# EAGLE design piezo-preamp-tickler_V1-01a (EAGLE 8.0.1)

## Sheet 1 of 2
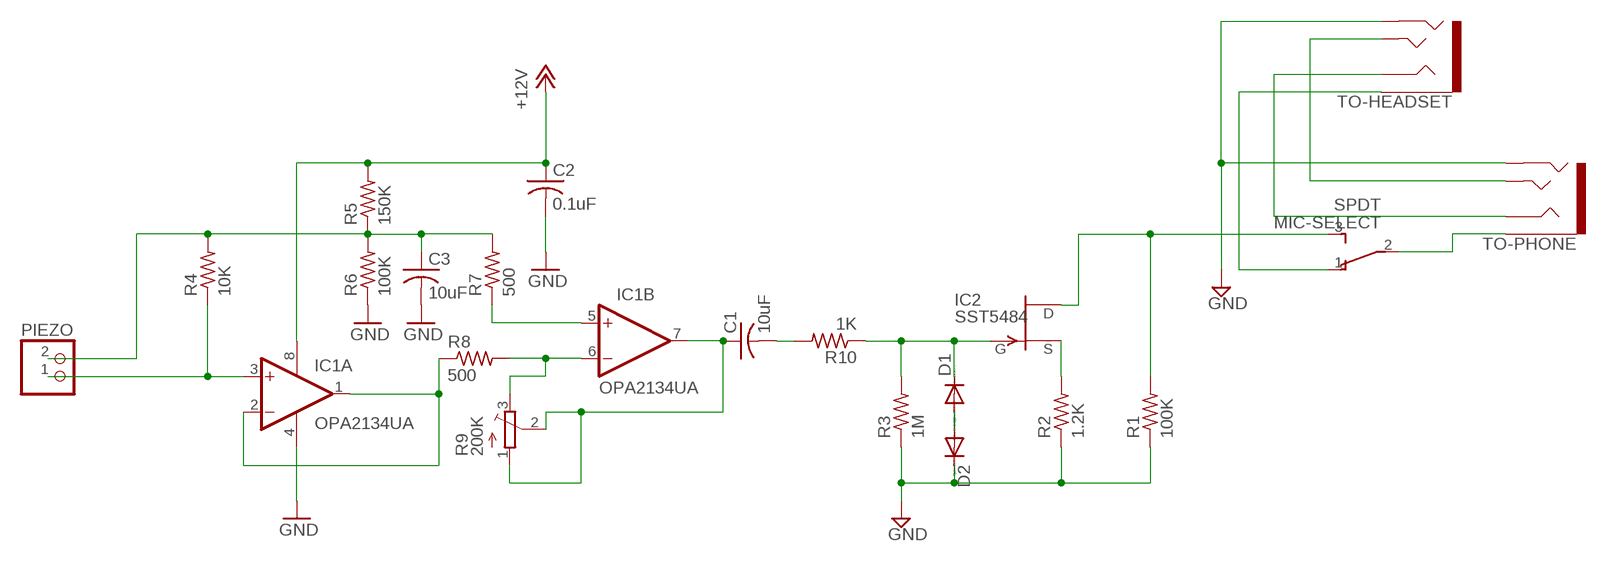
[diagram p0: schematic, sheet 1]

### Parts
C1  10uF  C-USC0805K  [C0805K]
C2  0.1uF  C-USC0805K  [C0805K]
C3  10uF  C-USC0805K  [C0805K]
D1  DIODE-SOD123  [SOD123]
D2  DIODE-SOD123  [SOD123]
IC1  OPA2134UA  [SO08]
IC2  SST5484  [SOT23]
MIC-SELECT  SPDT  SWITCH_SPDTTE-CONNECT  [SWITCH_SPDT-TE-CONNECT]
PIEZO  JST_2PIN-THM  [JST-PH-2-THM]
R1  100K  R-US_R0603  [R0603]
R2  1.2K  R-US_R0603  [R0603]
R3  1M  R-US_R0603  [R0603]
R4  10K  R-US_R0603  [R0603]
R5  150K  R-US_R0603  [R0603]
R6  100K  R-US_R0603  [R0603]
R7  500  R-US_R0603  [R0603]
R8  500  R-US_R0603  [R0603]
R9  200K  TRIMPOTTC33X  [TC33X]
R10  1K  R-US_R0603  [R0603]
TO-HEADSET  AUDIO-JACK3LGPADS  [AUDIO-JACK-TRRS-SMD]
TO-PHONE  AUDIO-JACK3LGPADS  [AUDIO-JACK-TRRS-SMD]

### Nets
+12V: C2.1 IC1.8(A:V+) R5.2 ; also sheet 2
GND: C2.2 C3.2 D2.C IC1.4(A:V-) R1.1 R2.1 R3.1 R6.1 TO-HEADSET.RING2 TO-PHONE.RING2 ; also sheet 2
N$1: D1.A D2.A
N$3: IC2.2(S) R2.2
N$5: IC1.5(B:+IN) R7.1
N$6: C1.1 IC1.7(B:OUT) R9.1(A) R9.2(S)
N$7: IC1.6(B:-IN) R8.2 R9.3(E)
N$8: C3.1 PIEZO.2 R4.2 R5.1 R6.2 R7.2
N$9: IC1.3(A:+IN) PIEZO.1 R4.1
N$10: D1.C IC2.3(G) R3.2 R10.1
N$11: C1.2 R10.2
N$12: MIC-SELECT.1 TO-HEADSET.EARTH
N$13: TO-HEADSET.TIP TO-PHONE.TIP
N$14: IC1.1(A:OUT) IC1.2(A:-IN) R8.1
N$15: TO-HEADSET.RING1 TO-PHONE.RING1
N$17: MIC-SELECT.2 TO-PHONE.EARTH
SELECT: IC2.1(D) MIC-SELECT.3 R1.2

## Sheet 2 of 2
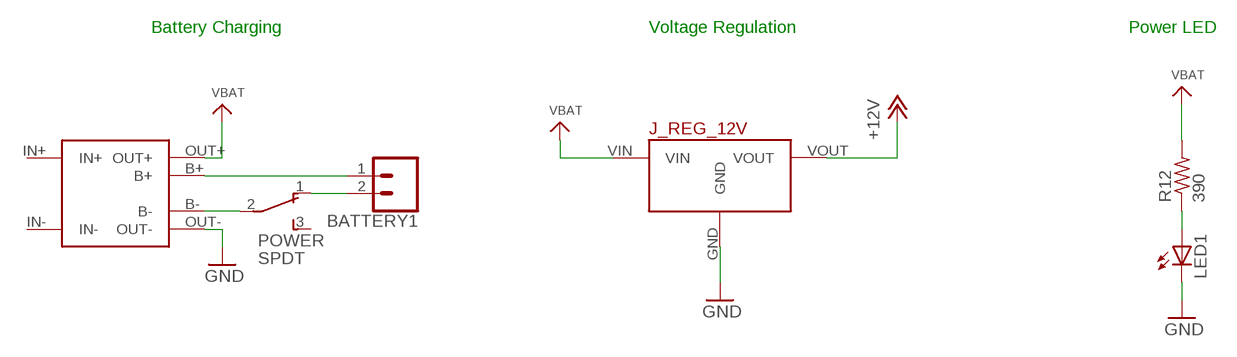
[diagram p1: schematic, sheet 2]

### Parts
BATTERY1  CONN_02LOCK  [1X02_LOCK]
J_REG_12V  POLOLU_VOLTAGE_REGULATORS_3PIN  [POLOLU_5V-12V_STEPUP_U3V12F5-U3V12F12]
LED1  LED3MM  [LED3MM]
POWER  SPDT  SWITCH_SPDTTE-CONNECT  [SWITCH_SPDT-TE-CONNECT]
R12  390  R-US_R0805  [R0805]
USB-LIPO-CHARGER  TP4056-MODULE  [TP4056-LITHIUM-PROTECTED-MODULE]

### Nets
+12V: J_REG_12V.VOUT ; also sheet 1
GND: J_REG_12V.GND LED1.K(C) USB-LIPO-CHARGER.OUT- ; also sheet 1
N$18: LED1.A R12.1
N$19: BATTERY1.1 USB-LIPO-CHARGER.B+
N$20: POWER.2 USB-LIPO-CHARGER.B-
N$21: BATTERY1.2 POWER.1
VBAT: J_REG_12V.VIN R12.2 USB-LIPO-CHARGER.OUT+
Unconnected: POWER.3

### Notes on the sheet
- Battery Charging | Voltage Regulation | Power LED

## Power pins joined to a net without a drawn wire
IN+: USB-LIPO-CHARGER.IN+
IN-: USB-LIPO-CHARGER.IN-

## Library data of the parts
BATTERY1 = SparkFun-Connectors:CONN_02: Multi connection point. Often used as Generic Header-pin footprint for 0.1 inch spaced/style header connections On any of the 0.1 inch spaced packages, you can populate with these: Break Away Headers - Straight <https://www.sparkfun.com/products/116> (PRT-00116) Break Away Male Headers - Right Angle <https://www.sparkfun.com/products/553> (PRT-00553) Female Headers <https://www.sparkfun.com/products/115> (PRT-00115) Break Away Headers - Machine Pin <https://www.sparkfun.com/products/117> (PRT-00117) Break Away Female Headers - Swiss Machine Pin <https://www.sparkfun.com/products/743> (PRT-00743) For SCREWTERMINALS and SPRING TERMINALS visit here: Screw Terimnals on SparkFun.com <https://www.sparkfun.com/search/results?term=Screw+Terminals> (5mm/3.5mm/2.54mm spacing) This device is also useful as a general connection point to wire up your design to another part of your project. Our various solder wires solder well into these plated through hole pads. Hook-Up Wire - Assortment (Stranded, 22 AWG) <https://www.sparkfun.com/products/11375> (PRT-11375) Hook-Up Wire - Assortment (Solid Core, 22 AWG) <https://www.sparkfun.com/products/11367> (PRT-11367) View the entire wire category on our website here <https://www.sparkfun.com/categories/141> Special notes: Molex polarized connector foot print use with: PRT-08233 with associated crimp pins and housings. 2.54_SCREWTERM for use with PRT-10571. 3.5mm Screw Terminal footprints for PRT-08084 5mm Screw Terminal footprints for use with PRT-08432
C1-C3 = adafruit:C-US: CAPACITOR, American symbol
D1 D2 = diode:DIODE-: DIODE
IC1 = linear:OPA2*: Dual Operational Amplifier Low Power, Single-Supply, Rail-To-Rail Operational Amplifier Source: http://focus.ti.com/lit/ds/symlink/opa2345.pdf http://focus.ti.com .. opa241.pdf http://focus.ti.com/lit/ds/symlink/opa2134.pdf
IC2 = transistor-fet:?548*: N-Channel JFETs Source: VISHAY 2N5484.pdf Compatible: TO92 2N5245 J304 J305 U310 J308 J309 J310 TO72 2N4416 2N4416A 2N3823 2N4351 3N169 3N170 3N171 MFE3002 TO18 2N3796 2N3797 MFE825 Source: Motorola European Master Guide Pacge 3-59
J_REG_12V = CMU-ArtFab:POLOLU_VOLTAGE_REGULATORS_3PIN: Polulu 5V Step-Up/Step-Down Voltage REgulator S7V7F5
LED1 = led:LED: LED OSRAM: - CHIPLED LG R971, LG N971, LY N971, LG Q971, LY Q971, LO R971, LY R971 LH N974, LH R974 LS Q976, LO Q976, LY Q976 LO Q996 - Hyper CHIPLED LW Q18S LB Q993, LB Q99A, LB R99A - SideLED LS A670, LO A670, LY A670, LG A670, LP A670 LB A673, LV A673, LT A673, LW A673 LH A674 LY A675 LS A676, LA A676, LO A676, LY A676, LW A676 LS A679, LY A679, LG A679 - Hyper Micro SIDELED® LS Y876, LA Y876, LO Y876, LY Y876 LT Y87S - SmartLED LW L88C, LW L88S LB L89C, LB L89S, LG L890 LS L89K, LO L89K, LY L89K LS L896, LA L896, LO L896, LY L896 - TOPLED LS T670, LO T670, LY T670, LG T670, LP T670 LSG T670, LSP T670, LSY T670, LOP T670, LYG T670 LG T671, LOG T671, LSG T671 LB T673, LV T673, LT T673, LW T673 LH T674 LS T676, LA T676, LO T676, LY T676, LB T676, LH T676, LSB T676, LW T676 LB T67C, LV T67C, LT T67C, LS T67K, LO T67K, LY T67K, LW E67C LS E67B, LA E67B, LO E67B, LY E67B, LB E67C, LV E67C, LT E67C LW T67C LS T679, LY T679, LG T679 LS T770, LO T770, LY T770, LG T770, LP T770 LB T773, LV T773, LT T773, LW T773 LH T774 LS E675, LA E675, LY E675, LS T675 LS T776, LA T776, LO T776, LY T776, LB T776 LHGB T686 LT T68C, LB T68C - Hyper Mini TOPLED® LB M676 - Mini TOPLED Santana® LG M470 LS M47K, LO M47K, LY M47K Source: http://www.osram.convergy.de LUXEON: - LUMILED® LXK2-PW12-R00, LXK2-PW12-S00, LXK2-PW14-U00, LXK2-PW14-V00 LXK2-PM12-R00, LXK2-PM12-S00, LXK2-PM14-U00 LXK2-PE12-Q00, LXK2-PE12-R00, LXK2-PE12-S00, LXK2-PE14-T00, LXK2-PE14-U00 LXK2-PB12-K00, LXK2-PB12-L00, LXK2-PB12-M00, LXK2-PB14-N00, LXK2-PB14-P00, LXK2-PB14-Q00 LXK2-PR12-L00, LXK2-PR12-M00, LXK2-PR14-Q00, LXK2-PR14-R00 LXK2-PD12-Q00, LXK2-PD12-R00, LXK2-PD12-S00 LXK2-PH12-R00, LXK2-PH12-S00 LXK2-PL12-P00, LXK2-PL12-Q00, LXK2-PL12-R00 Source: www.luxeon.com KINGBRIGHT: KA-3528ASYC Source: www.kingbright.com
MIC-SELECT POWER = CMU-ArtFab:SWITCH_SPDT
PIEZO = adafruit:JST_2PIN: JST 2-Pin Connectors of various flavors SMT-RA (S2B-PH-SM4) 4UConnector #17311 SMT (B2B-PH-SM4) THM-RA (S2B-PH) THM (B2B-PH)
R1-R8 R10 R12 = CMU-ArtFab:R-US_: RESISTOR, American symbol
R9 = adafruit:TRIMPOT: SMT trimmer potentiometer part number TC33X http://www.ladyada.net/library/eagle
TO-HEADSET TO-PHONE = Daniel:AUDIO-JACK3: Audio jack - 3.5mm TRRS variety - two rings.
USB-LIPO-CHARGER = CMU-ArtFab:TP4056-MODULE

## Net classes
0 default: width 0.152 mm, clearance 0.2 mm

## Board
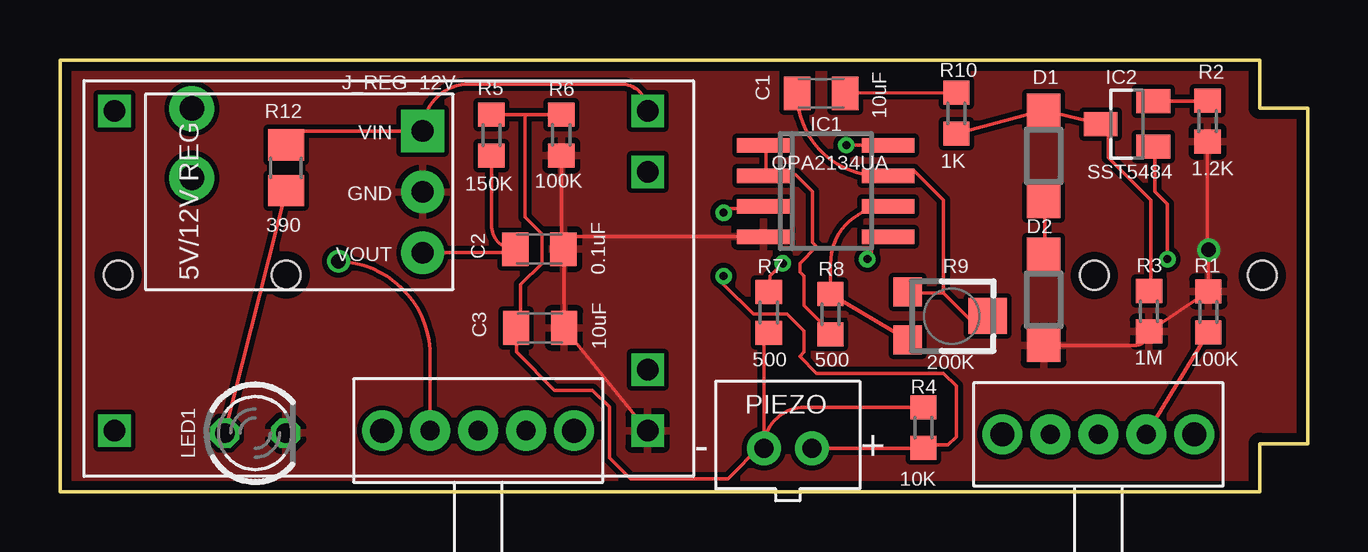
[diagram p2: board, top side]
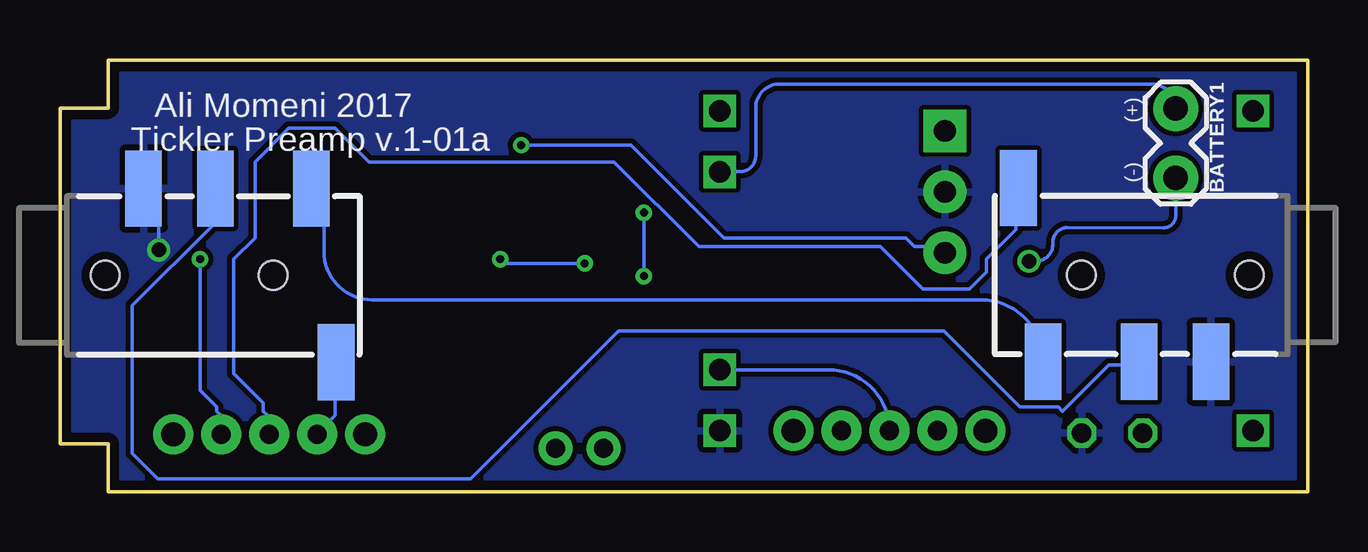
[diagram p3: board, bottom side, seen from below]

Size 52 x 18 mm. Coordinates in mm from the lower left corner, seen from the top.
Outline: 0,0 50,0 50,2 52,2 52,16 50,16 50,18 0,18 0,0
Copper layers (1*16): Top 0.0356mm / dielectric 1.5011mm / Bottom 0.0356mm
Design rules "oshpark-2layer": minimum track width 6mil, minimum drill 13mil, track to track 6mil, track to pad 6mil, pad to pad 6mil, via to via 6mil, smd to smd 6mil, copper to edge 15mil, drill to drill 6mil, minimum pad ring 7mil, minimum via ring 7mil, stop-mask expansion 2.5mil, vias tented up to drill 0mil, thermal gap 10mil

### Footprints (pad centres in the part's own frame; a part is rotated, then mirrored left to right if it is on the bottom)
1X02_LOCK = drill 1.016 pad 1.88: 1 -0.178,0; 2 2.718,0
C0805K = smd 1.1 x 1.4: 1 -1,0; 2 1,0
SOD123 = smd 1.4 x 1.4: A 1.9,0; C -1.9,0
SO08 = smd 0.6 x 2.2: 1 -1.905,-2.6; 2 -0.635,-2.6; 3 0.635,-2.6; 4 1.905,-2.6; 5 1.905,2.6; 6 0.635,2.6; 7 -0.635,2.6; 8 -1.905,2.6
SOT23 = smd 1 x 1.4: 1 -0.95,-1.1; 2 0.95,-1.1; 3 0,1.1
POLOLU_5V-12V_STEPUP_U3V12F5-U3V12F12 = drill 0.9 pad 1.778: GND 0,-6.35; VOUT -2.54,-6.35 | drill 0.9 pad 1.778 square: VIN 2.54,-6.35
LED3MM = drill 0.813 octagon: A -1.27,0; K 1.27,0
SWITCH_SPDT-TE-CONNECT = drill 0.8 pad 1.676: 1 2,0; 2 4,0; 3 6,0 | drill 1 pad 1.676: MOUNT1 0,0; MOUNT2 8,0
JST-PH-2-THM = drill 0.8 pad 1.422: 1 1,0; 2 -1,0
R0603 = smd 1 x 1.1: 1 -0.85,0; 2 0.85,0
TC33X = smd 1.2 x 1.2: 1 -1,-1.825; 3 1,-1.825 | smd 1.5 x 1.6: 2 0,1.5
R0805 = smd 1.3 x 1.5: 1 -0.95,0; 2 0.95,0
AUDIO-JACK-TRRS-SMD = smd 1.524 x 3.175: EARTH 11.227,-3.619; RING1 6.2,3.619; RING2 3.2,3.619; TIP 10.2,3.619 | hole 1.2: 1.6,0; 8.6,0
TP4056-LITHIUM-PROTECTED-MODULE = drill 0.9 square: B+ 10.795,4.445; B- 10.795,-3.81; IN+ -11.43,6.985; IN- -11.43,-6.35; OUT+ 10.795,6.985; OUT- 10.795,-6.35

### Placement (x,y rotation side)
BATTERY1  5.5,15.79 270 bottom
C1  31.73,16.61 0 top
C2  19.98,10.11 0 top
C3  20.01,6.83 0 top
D1  41,14 270 top
D2  41,8 90 top
IC1  31.92,12.54 270 top
IC2  44.47,15.33 90 top
J_REG_12V  8.77,12.5 90 top
LED1  8.14,2.44 0 top
MIC-SELECT  39.28,2.38 0 top
PIEZO  30.34,1.81 0 top
POWER  13.43,2.54 0 top
R1  47.86,7.49 270 top
R2  47.83,15.45 90 top
R3  45.39,7.52 90 top
R4  35.99,2.67 90 top
R5  17.98,14.86 270 top
R6  20.9,14.87 90 top
R7  29.54,7.46 270 top
R8  32.12,7.39 90 top
R9  37.16,7.32 270 top
R10  37.37,15.78 90 top
R12  9.42,13.5 90 top
TO-HEADSET  51.72,9.02 0 bottom
TO-PHONE  0.82,9.03 180 bottom
USB-LIPO-CHARGER  13.7,8.89 0 top

### Tracks (layer width: path | path; a pad name or v marks a point on that pad's centre or on a via)
+12V  (via drill 0.33)
  Top 0.152: J_REG_12V.VOUT 18.83,9.96 arc90 C2.1 arc-90 17.98,11.11 R5.2 | v32.77,14.45 34.36,14.45 IC1.8
  Bottom 0.152: v32.77,14.45 28.19,14.45 24.32,10.57 16.74,10.57 16.39,10.22 15.33,10.22 15.15,10.04 J_REG_12V.VOUT
GND  (via drill 0.6)
  Top 0.152: C2.2 arc-90 21.01,10.08 C3.2 USB-LIPO-CHARGER.OUT- | C2.2 arc-90 20.9,10.19 R6.1 | C2.2 arc-90 21.5,10.63 IC1.4 | R2.1 47.83,10.13 arc90 v47.88,10.08 arc90 47.86,10.06 R1.1 R3.1 arc-90 44.82,6.1 D2.C
  Bottom 0.152: v47.88,10.08 47.88,12 arc-90 TO-HEADSET.RING2
  pour Top: -1,19.03 53,19.03 53,-0.97 -1,-0.97
  pour Bottom: -1,19.03 53,19.03 53,-0.97 -1,-0.97
N$1
  Top 0.152: D2.A 41.05,10.04 41.05,11.98 D1.A
N$3
  Top 0.152: IC2.2 47.83,16.28 R2.2
N$5  (via drill 0.33)
  Top 0.152: v30.13,9.52 29.6,8.99 29.6,8.46 R7.1 | v33.65,9.69 33.83,9.87 33.83,10.4 34.01,10.57 34.36,10.57 IC1.5
  Bottom 0.152: v30.13,9.52 33.48,9.52 v33.65,9.69
N$6
  Top 0.152: C1.1 arc90 34.16,13.17 IC1.7 34.53,13.21 34.71,13.39 35.59,13.39 36.83,12.16 36.83,8.28 | 36.83,8.28 35.42,8.28 R9.1 | 36.83,8.28 37.88,7.22 38.59,7.22 R9.2
N$7
  Top 0.152: R9.3 R8.2 32.12,9.49 arc-90 IC1.6
N$8
  Top 0.152: R7.2 arc90 29.34,6.41 PIEZO.2 | PIEZO.2 arc-90 31.05,3.52 R4.2 | R6.2 19.38,15.72 | 19.38,15.72 18,15.72 arc90 R5.1 | PIEZO.2 29.25,1.94 27.84,0.53 23.79,0.53 22.91,1.41 22.91,3.52 22.2,4.23 20.61,4.23 19.03,5.82 19.03,6.7 C3.1 19.03,6.87 19.21,7.05 19.21,8.63 20.09,9.52 20.09,10.75 19.38,11.45 19.38,15.72
N$9  (via drill 0.33)
  Top 0.152: PIEZO.1 35.98,1.81 arc90 R4.1 36.12,1.94 37,1.94 37.35,2.29 37.35,4.41 36.83,4.93 31.54,4.93 30.84,5.64 31.01,5.82 31.01,6.7 30.31,7.4 28.9,7.4 27.66,8.63 v27.66,8.99 | v27.66,11.63 27.84,11.8 29.25,11.8 IC1.3
  Bottom 0.152: v27.66,8.99 v27.66,11.63
N$10
  Top 0.152: R10.1 D1.C IC2.3 43.52,15.15 43.7,14.98 43.7,13.92 45.46,12.16 45.46,8.46 R3.2
N$11
  Top 0.152: C1.2 R10.2
N$12
  Bottom 0.152: TO-HEADSET.EARTH 40.53,5.29 40.53,3.17 41.23,2.47 MIC-SELECT.1
N$13
  Bottom 0.152: TO-PHONE.TIP arc-90 13.61,8 39,8 arc90 41,10 41,12 arc90 41.52,12.52 TO-HEADSET.TIP
N$14
  Top 0.152: 29.43,13.21 30.66,13.21 31.36,12.51 31.36,10.4 31.54,10.22 30.84,9.52 30.84,9.16 31.01,8.99 31.01,7.75 32.07,6.7 R8.1 | 29.43,13.21 29.43,14.27 IC1.1 | 29.43,13.21 IC1.2
N$15
  Bottom 0.152: TO-PHONE.RING1 7.05,5.29 8.28,5.29 10.22,3.35 10.4,3.52 11.98,3.52 15.15,6.7 28.72,6.7 34.89,0.53 47.93,0.53 48.98,1.59 48.98,7.75 45.64,11.1 45.64,12.51 TO-HEADSET.RING1
N$17
  Bottom 0.152: TO-PHONE.EARTH 12.16,12.51 12.16,10.92 13.39,9.69 13.39,9.16 14.1,8.46 16.03,8.46 17.8,10.22 25.37,10.22 28.9,13.74 39.12,13.74 40.53,15.15 42.46,15.15 43.87,13.74 43.87,10.57 44.76,9.69 44.76,4.93 43.52,3.7 43.52,3.35 43.34,3.17 43.34,2.47 MIC-SELECT.2
N$18
  Top 0.152: LED1.A R12.1
N$19
  Bottom 0.152: USB-LIPO-CHARGER.B+ 23.66,13.34 arc-90 23,14 23,16 arc90 22,17 6.52,17 arc90 BATTERY1.1
N$20
  Bottom 0.152: USB-LIPO-CHARGER.B- 19.97,5.08 arc90 POWER.2
N$21  (via drill 0.6)
  Top 0.152: POWER.1 15.43,5.57 arc90 v11.61,9.61
  Bottom 0.152: 5.46,13.05 arc-90 BATTERY1.2 5.5,11.51 arc90 6,11 10.03,11.02 arc-90 10.62,10.32 arc90 11.34,9.61 v11.61,9.61
SELECT  (via drill 0.33)
  Top 0.152: MIC-SELECT.3 R1.2 | v46.16,9.69 46.16,11.98 45.64,12.51 45.64,14.27 IC2.1
  Bottom 0.152: v46.16,9.69 46.16,4.23 45.46,3.52 45.46,3.35 45.28,3.17 45.28,2.47 MIC-SELECT.3
VBAT
  Top 0.152: R12.2 arc-90 10.01,15.04 J_REG_12V.VIN arc-90 17.08,17 23.37,17 arc-90 USB-LIPO-CHARGER.OUT+

### Text on the board
bNames: Ali Momeni 2017 | Tickler Preamp v.1-01a